# Altium schematic sheet VoltageRegulator3.3V.SchDoc
size 381 x 241 mm
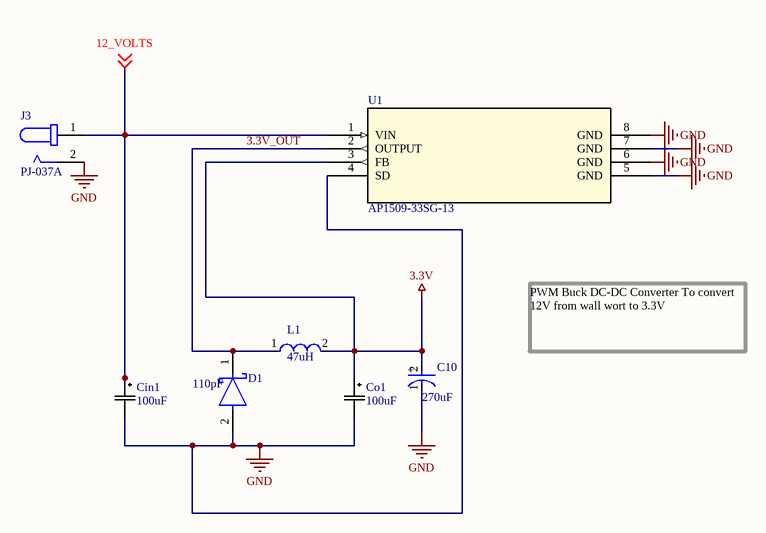
[diagram p0: VoltageRegulator3.3V.SchDoc]

## Parts
C10  Capacitance: 270uF  [FP-OS-CON-SMT-E7-MFG]  (hidden comment: 16SVPF270M)
Cin1  Capacitance: 100uF  [CAP_PC_8X7_NCH]  (hidden comment: PCV1D101MCL2GS)
Co1  Capacitance: 100uF  [CAP_PC_8X7_NCH]  (hidden comment: PCV1D101MCL2GS)
D1  Capacitance: 110pF  [FP-SMA-MFG]  (hidden comment: B140-13-F)
J3  PJ-037A  [CUI_PJ-037A]
L1  value 47uH  [FP-LQM21DH_70-IPC_A]  (hidden comment: LQM21DH470M70L)
U1  AP1509-33SG-13  [SOP-8L_DIO]

## Nets
3.3V: C10.2(A) Co1.1 L1.2 U1.3(FB)
GND: C10.1(C) Cin1.2 Co1.2 D1.2(A) J3.2 U1.4(SD) U1.5(GND) U1.6(GND) U1.7(GND) U1.8(GND)
3.3V_OUT: D1.1(C) L1.1 U1.2(OUTPUT)
12_VOLTS: Cin1.1 J3.1 U1.1(VIN) ; off-sheet 12_VOLTS

## Notes on the sheet
- PWM Buck DC-DC Converter To convert 12V from wall wort to 3.3V
- (in symbol CMP-05428-001376-1) +

## Library data of the parts
C10 = CMP-05428-001376-1: Conductive Polymer Aluminum Solid Capacitors (OS-CON) 270uF ±20% 16V RADIAL SMT 8x6.9mm; Manufacturer: Panasonic; Polarity: Polar; ESR (Equivalent Series Resistance): 22mR; Leakage Current: 864uA; Life (Hours): 5000Hour; Ripple Current (AC): 3.3A; Dissipation Factor: 12%; Height: 6.9mm; Voltage: 16V; Termination: SMD/SMT; Lead Free: Lead Free; Max Operating Temperature: 105°C; Mount: Surface Mount; Radiation Hardening: No; Length: 6.9mm; Diameter: 8mm; REACH SVHC: No SVHC; Construction: Cylindrical; Case/Package: Radial; Voltage Rating: 16V; Min Operating Temperature: -55°C; Package Quantity: 1000; Number of Pins: 7; Packaging: Tape and Reel; Height - Seated (Max): 0.276inch; Series: OS-CON™, SVPF; Ripple Current: 3.3A; Tolerance: 20%; Voltage Rating (DC): 16V; RoHS Compliant: Yes; Supplier 1: RSComponents; Supplier Part Number 1: 7955213; Manufacturer Part Number: 16SVPF270M; RoHS: Yes; Category: Aluminum Electrolytic Capacitors; Stock 1: 20; Pricing 1: 5=1.40600, 50=1.30800, 100=1.21000, 250=1.13800, 500=1.01200 (GBP); ComponentLink1URL: https://datasheet.ciiva.com/26840/getdatasheetpartid-743670-26840731.pdf?src-supplier=Verical; ComponentLink1Description: https://datasheet.ciiva.com/26840/getdatasheetpartid-743670-26840731.pdf?src-supplier=Verical; ComponentLink2URL: https://datasheet.ciiva.com/22746/1734360-22746191.pdf?src-supplier=Element14; ComponentLink2Description: https://datasheet.ciiva.com/22746/1734360-22746191.pdf?src-supplier=Element14
Cin1 Co1 = PCV1D101MCL2GS: Cap Aluminum Polymer 100uF 20VDC 20% (8 X 7mm) SMD 0.042 Ohm 1400mA 3000h 105C Automotive T/R; Mfr_Name: Nichicon; Voltage Rating (DC): 20V; ESR (Equivalent Series Resistance): 42mR; Ripple Current: 1.4A; Leakage Current: 400uA; Polarity: Polar; Dissipation Factor: 0.12%; Life (Hours): 3000Hour; Copyright: Copyright (C) 2022 Ultra Librarian. All rights reserved.; Manufacturer_Part_Number: PCV1D101MCL2GS; Digi-Key_Part_Number_1: 493-4532-1-ND; Digi-Key_Part_Number_2: 493-4532-2-ND; Digi-Key_Part_Number_3: 493-4532-6-ND; RefDes: RefDes; Type: DEV; Supplier 1: Digi-Key; Manufacturer: Nichicon; Manufacturer Part Number: PCV1D101MCL2GS; RoHS: Yes; Category: Polymer Capacitors; Stock 1: 12604; Pricing 1: 1=2.46000, 10=1.99300, 50=1.73900, 100=1.52170, 500=1.15938 (USD); Mount: Surface Mount,PCB; Case/Package: Radial; Min Operating Temperature: -55°C; Max Operating Temperature: 105°C; Tolerance: 20%; Package Quantity: 1; Voltage Rating: 20V; Packaging: Tape and Reel; Termination: SMD/SMT; Voltage: 20V; Series: CV; Diameter: 8mm; Length: 7mm; Height: 7mm; Height - Seated (Max): 0.276inch; Lead Pitch: 3.2mm; RoHS Compliant: Yes; ComponentLink1URL: https://datasheet.ciiva.com/115/e-cv-115994.pdf?src-supplier=Digi-Key; ComponentLink1Description: https://datasheet.ciiva.com/115/e-cv-115994.pdf?src-supplier=Digi-Key; ComponentLink2URL: https://datasheet.ciiva.com/115/e-cv-115995.pdf?src-supplier=Digi-Key; ComponentLink2Description: https://datasheet.ciiva.com/115/e-cv-115995.pdf?src-supplier=Digi-Key; ComponentLink3URL: https://datasheet.ciiva.com/115/e-cv-115996.pdf?src-supplier=Digi-Key; ComponentLink3Description: https://datasheet.ciiva.com/115/e-cv-115996.pdf?src-supplier=Digi-Key
  Cin1: Supplier Part Number 1: 493-4532-1-ND
D1 = CMP-2000-05096-2: DIODE SCHOTTKY 40V 1A SMA; Manufacturer 1: Diodes; Element Configuration: Single; Forward Voltage: 500mV; Max Forward Surge Current (Ifsm): 30A; Max Reverse Current: 500uA; Polarity: Standard; Package Quantity: 5000; Average Rectified Current: 1A; Height: 2.1mm; Max Operating Temperature: 150°C; Radiation Hardening: No; Mount: Surface Mount; REACH SVHC: No SVHC; Contact Plating: Tin; Width: 2.92mm; RoHS Compliant: Yes; Max Repetitive Reverse Voltage (Vrrm): 40V; Current Rating: 1A; Termination: SMD/SMT; Number of Pins: 2; Max Reverse Voltage (DC): 40V; Series: B140; Length: 4.6mm; Forward Current: 1A; Voltage Rating (DC): 40V; Lead Free: Lead Free; Weight: 0.004233oz; Output Current: 1A; Case/Package: SMA; Min Operating Temperature: -65°C; Packaging: Cut Tape; Peak Non-Repetitive Surge Current: 30A; Supplier 1: Digi-Key; Supplier Part Number 1: B140-FDICT-ND; Manufacturer Part Number 1: B140-13-F; RoHS: Yes; Category: Rectifier Diodes; Stock 1: 157255; Pricing 1: 1=0.41000, 10=0.33200, 100=0.17600, 500=0.11576, 1000=0.07872, 2000=0.07100 (USD); ComponentLink1URL: https://datasheet.ciiva.com/15220/getdatasheetpartid-115924-15220197.pdf?src-supplier=Verical; ComponentLink1Description: https://datasheet.ciiva.com/15220/getdatasheetpartid-115924-15220197.pdf?src-supplier=Verical; ComponentLink2URL: https://datasheet.ciiva.com/912/ds13002-912361.pdf?src-supplier=Digi-Key; ComponentLink2Description: https://datasheet.ciiva.com/912/ds13002-912361.pdf?src-supplier=Digi-Key; ComponentLink3URL: https://datasheet.ciiva.com/912/ds13002-912362.pdf?src-supplier=Digi-Key; ComponentLink3Description: https://datasheet.ciiva.com/912/ds13002-912362.pdf?src-supplier=Digi-Key; ComponentLink4URL: https://datasheet.ciiva.com/912/ds13002-912360.pdf?src-supplier=Digi-Key; ComponentLink4Description: https://datasheet.ciiva.com/912/ds13002-912360.pdf?src-supplier=Digi-Key
J3 = PJ-037A: 2.0 mm Center Pin, 2.5 A, Right Angle, Through Hole, Dc Power Jack Connector; Package: None; MP: PJ-037A; Value: *; Availability: Unavailable; Price: None
L1 = CMP-06042-008997-1: Multilayer Type Inductor for Automotive, 0805 (2012), 47μH, 20%, 2.99Ω, 200mA; Manufacturer: Murata; Supplier 1: Digi-Key; Supplier Part Number 1: 490-18465-1-ND; Manufacturer Part Number: LQM21DH470M70L; RoHS: Yes; Category: Fixed Inductors; Stock 1: 20; Pricing 1: 1=0.25000, 10=0.22700, 25=0.19840, 50=0.17000, 100=0.15580, 250=0.14164, 500=0.13312, 1000=0.10197 (USD)
U1 = AP1509-33SG-13: No Description Available; Mfr_Name: Diodes Inc; Copyright: Copyright (C) 2022 Ultra Librarian. All rights reserved.; Manufacturer_Part_Number: AP1509-33SG-13; Digi-Key_Part_Number_1: AP1509-33SGDICT-ND; Digi-Key_Part_Number_2: AP1509-33SGDIDKR-ND; Digi-Key_Part_Number_3: AP1509-33SGDITR-ND; RefDes: RefDes; Type: DEV